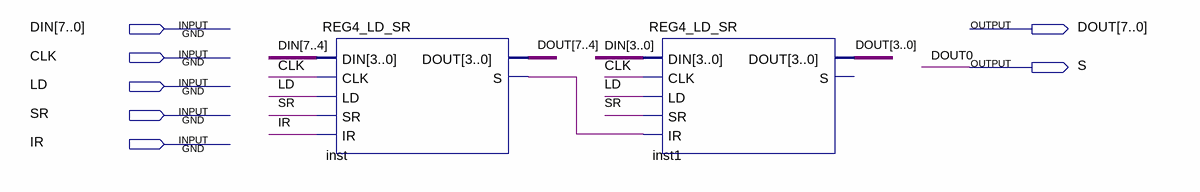
[diagram p0: schematic sheet]
// Quartus schematic REG8_LD_SR.bdf as structural Verilog: 2 symbols, 7 pins
module REG8_LD_SR (
  input  [7:0] DIN,
  input  CLK,
  input  LD,
  input  SR,
  input  IR,
  output [7:0] DOUT,
  output S
);

  wire inst_s;

  REG4_LD_SR inst (.DIN(DIN[7:4]), .CLK(CLK), .LD(LD), .SR(SR), .IR(IR), .DOUT(DOUT[7:4]), .S(inst_s));
  REG4_LD_SR inst1 (.DIN(DIN[3:0]), .CLK(CLK), .LD(LD), .SR(SR), .IR(inst_s), .DOUT(DOUT[3:0]));  // open: S

  assign S = DOUT[0];
endmodule
